# Altium schematic sheet InputsFibras.SchDoc
size A4
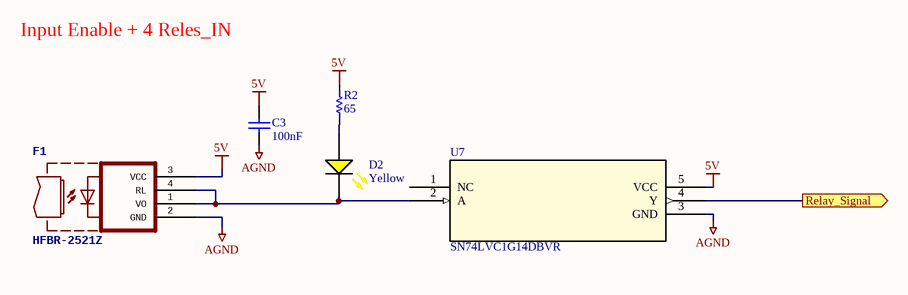
[diagram p0: InputsFibras.SchDoc]

## Parts
C3  100nF  [CAP_0603]
D2  Yellow  [LED_0603_Yellow]
F1  HFBR-2521Z  [FO_Rx_HFBR-2521Z]
R2  65  [RES_0805]
U7  SN74LVC1G14DBVR  [DBV5-M]

## Ports
Relay_Signal (out)

## Nets
5V: C3.1 F1.3(VCC) R2.2 U7.5(VCC)
AGND: C3.2 F1.2(GND) U7.3(GND)
Relay_Signal: U7.4(Y) ; port Relay_Signal
NetD2_1: D2.1(A) R2.1
NetD2_2: D2.2(K) F1.1(VO) F1.4(RL) U7.2(A)

Not connected (* = marked no-connect by the designer): U7 1(NC)

## Notes on the sheet
- Input Enable + 4 Reles_IN

## Library data of the parts
C3 = Cap_0603: 0.1µF ±10% 50V Ceramic Capacitor X7R 0603 (1608 Metric); MF: KEMET; MFP: C0603C104K5RACTU; Created: 2020_06_15_DAarancibia; Package: 0603; Value: 100nF; Supplier 1: Digi-Key; Supplier Part Number 1: 399-5089-1-ND
D2 = Led_0603_Yellow: Yellow 590nm LED Indication - Discrete 2V 0603 (1608 Metric); MF: Würth Elektronik; MFP: 150060YS75000; Created: 2020_07_06_DAarancibia; Package: 0603; Value: Yellow; Supplier 1: Digi-Key; Supplier Part Number 1: 732-4981-1-ND
F1 = FO_Rx_HFBR-2521: Fiber Optic Receiver  5MBd -43dBm 4.75V ~ 5.25V 10mA; MF: Broadcom Limited; MFP: HFBR-2521Z; Created: 2020_07_06_DArancibia; Package: *; Value: HFBR-2521Z; Supplier 1: Digi-Key; Supplier Part Number 1: 516-2062-ND
R2 = Res_0805: 10 kOhms ±1% 0.125W, 1/8W Chip Resistor 0805 (2012 Metric) Automotive AEC-Q200 Thick Film; MF: Panasonic Electronic Components; MFP: ERJ-6ENF1002V; Value: 10k; Created: 2020_06_15_DAarancibia; Package: 0805; Supplier 1: Digi-Key; Supplier Part Number 1: P10.0KCCT-ND
U7 = SN74LVC1G14DBVR: No Description Available; Mfr_Name: Texas Instruments; Copyright: Copyright (C) 2023 Ultra Librarian. All rights reserved.; Manufacturer_Part_Number: SN74LVC1G14DBVR; RefDes: RefDes; Type: DEV